# EAGLE design PhotoTriac (EAGLE 7.2.0)
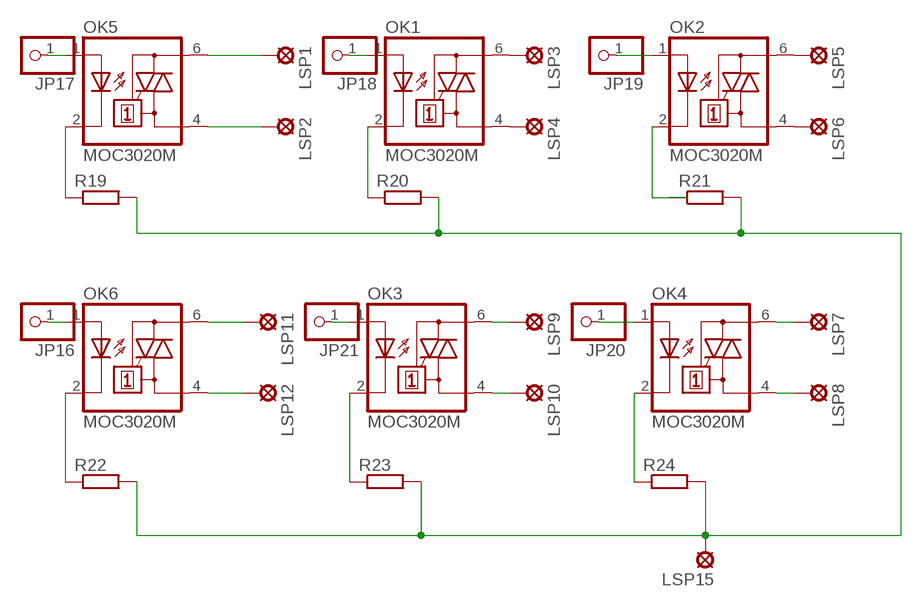
[diagram p0: schematic, sheet 1]

## Parts
JP16  PINHD-1X1  [1X01]
JP17  PINHD-1X1  [1X01]
JP18  PINHD-1X1  [1X01]
JP19  PINHD-1X1  [1X01]
JP20  PINHD-1X1  [1X01]
JP21  PINHD-1X1  [1X01]
LSP1  LSP10  [LSP10]
LSP2  LSP10  [LSP10]
LSP3  LSP10  [LSP10]
LSP4  LSP10  [LSP10]
LSP5  LSP10  [LSP10]
LSP6  LSP10  [LSP10]
LSP7  LSP10  [LSP10]
LSP8  LSP10  [LSP10]
LSP9  LSP10  [LSP10]
LSP10  LSP10  [LSP10]
LSP11  LSP10  [LSP10]
LSP12  LSP10  [LSP10]
LSP15  LSP10  [LSP10]
OK1  MOC3020M  [DIL06]
OK2  MOC3020M  [DIL06]
OK3  MOC3020M  [DIL06]
OK4  MOC3020M  [DIL06]
OK5  MOC3020M  [DIL06]
OK6  MOC3020M  [DIL06]
R19  R-EU_0207/10  [0207/10]
R20  R-EU_0207/10  [0207/10]
R21  R-EU_0207/10  [0207/10]
R22  R-EU_0207/10  [0207/10]
R23  R-EU_0207/10  [0207/10]
R24  R-EU_0207/10  [0207/10]

## Nets
N$39: JP17.1 OK5.1(A)
N$63: JP18.1 OK1.1(A)
N$64: JP19.1 OK2.1(A)
N$66: JP20.1 OK4.1(A)
N$79: LSP1.MP OK5.6(A2)
N$80: LSP2.MP OK5.4(A1)
N$81: LSP3.MP OK1.6(A2)
N$82: LSP4.MP OK1.4(A1)
N$83: LSP5.MP OK2.6(A2)
N$84: LSP6.MP OK2.4(A1)
N$85: LSP7.MP OK4.6(A2)
N$86: LSP8.MP OK4.4(A1)
N$87: LSP9.MP OK3.6(A2)
N$88: LSP10.MP OK3.4(A1)
N$89: LSP11.MP OK6.6(A2)
N$90: LSP12.MP OK6.4(A1)
N$91: JP21.1 OK3.1(A)
N$92: OK2.2(C) R21.1
N$93: OK1.2(C) R20.1
N$94: OK5.2(C) R19.1
N$95: JP16.1 OK6.1(A)
N$96: OK3.2(C) R23.1
N$97: OK4.2(C) R24.1
N$98: OK6.2(C) R22.1
N$122: LSP15.MP R19.2 R20.2 R21.2 R22.2 R23.2 R24.2

## Library data of the parts
JP16-JP21 = pinhead:PINHD-1X1: PIN HEADER
LSP1-LSP12 LSP15 = solpad:LSP10: SOLDER PAD drill 1.0 mm, distributor Buerklin, 12H555
OK1-OK6 = optocoupler:MOC30*M: RANDOM-PHASE OPTOISOLATORS TRIAC DRIVER OUTPUT Source: http://www.fairchildsemi.com MOC3020-M.pdf; MF: FAIRCHILD SEMICONDUCTOR; MPN: MOC3020-M; OC_FARNELL: 1505425; OC_NEWARK: 72K8895
R19-R24 = resistor:R-EU_: RESISTOR, European symbol

## Board
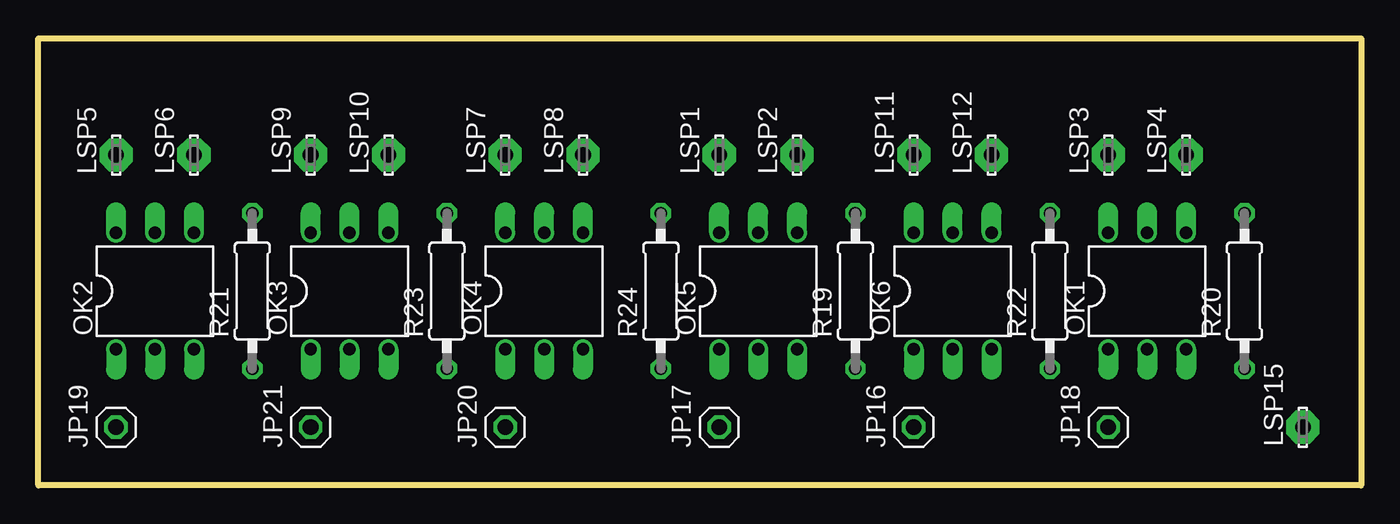
[diagram p1: board, top side]
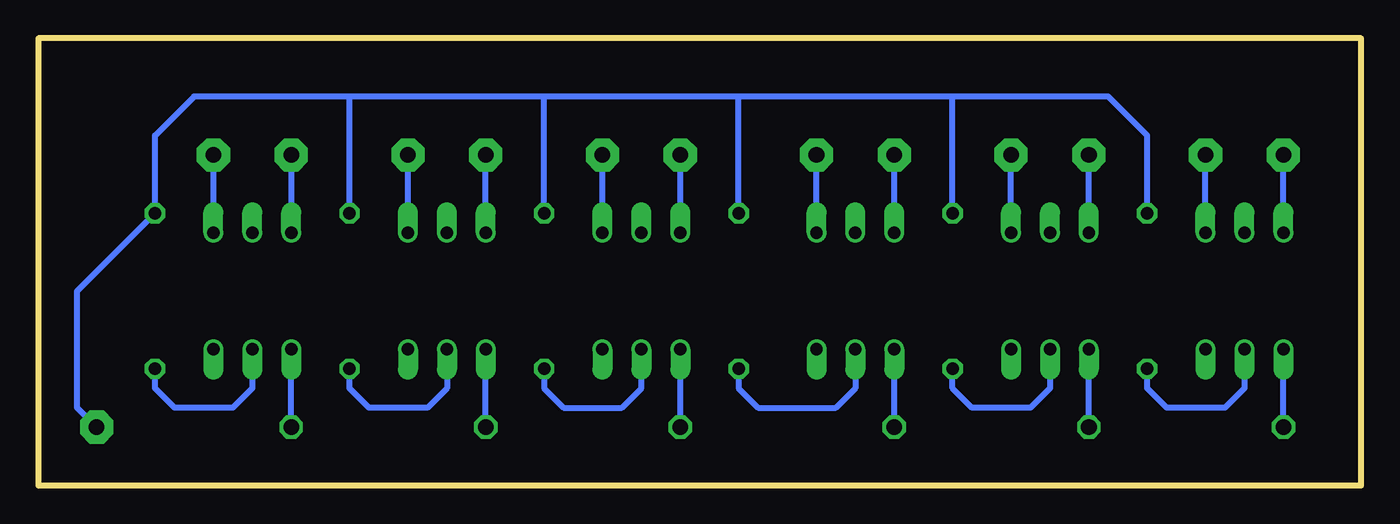
[diagram p2: board, bottom side, seen from below]

Size 86.36 x 29.21 mm. Coordinates in mm from the lower left corner, seen from the top.
Outline: 0,0 0,29.21 86.36,29.21 86.36,0 0,0
Copper layers (1*16): Top 0.035mm / dielectric 1.5mm / Bottom 0.035mm
Design rules "default": minimum track width 10mil, minimum drill 24mil, track to track 8mil, track to pad 8mil, pad to pad 8mil, via to via 8mil, smd to smd 8mil, copper to edge 40mil, drill to drill 8mil, minimum pad ring 10mil, minimum via ring 8mil, stop-mask expansion 4mil, vias tented up to drill 0mil, thermal gap 10mil

### Footprints (pad centres in the part's own frame; a part is rotated, then mirrored left to right if it is on the bottom)
1X01 = drill 1.016 octagon: 1 0,0
LSP10 = drill 1.016 pad 2.159 octagon: MP 0,0
DIL06 = drill 0.813 offset: 1 -2.54,-3.81; 2 0,-3.81; 3 2.54,-3.81; 4 2.54,3.81; 5 0,3.81; 6 -2.54,3.81
0207/10 = drill 0.813 octagon: 1 -5.08,0; 2 5.08,0

### Placement (x,y rotation side)
JP16  57.15,3.81 90 top
JP17  44.45,3.81 90 top
JP18  69.85,3.81 90 top
JP19  5.08,3.81 90 top
JP20  30.48,3.81 90 top
JP21  17.78,3.81 90 top
LSP1  44.45,21.59 90 top
LSP2  49.53,21.59 90 top
LSP3  69.85,21.59 90 top
LSP4  74.93,21.59 90 top
LSP5  5.08,21.59 90 top
LSP6  10.16,21.59 90 top
LSP7  30.48,21.59 90 top
LSP8  35.56,21.59 90 top
LSP9  17.78,21.59 90 top
LSP10  22.86,21.59 90 top
LSP11  57.15,21.59 90 top
LSP12  62.23,21.59 90 top
LSP15  82.55,3.81 90 top
OK1  72.39,12.7 0 top
OK2  7.62,12.7 0 top
OK3  20.32,12.7 0 top
OK4  33.02,12.7 0 top
OK5  46.99,12.7 0 top
OK6  59.69,12.7 0 top
R19  53.34,12.7 90 top
R20  78.74,12.7 90 top
R21  13.97,12.7 90 top
R22  66.04,12.7 90 top
R23  26.67,12.7 90 top
R24  40.64,12.7 90 top

### Tracks (layer width: path | path; a pad name or v marks a point on that pad's centre or on a via)
N$39
  Bottom 0.406: JP17.1 OK5.1
N$63
  Bottom 0.406: JP18.1 OK1.1
N$64
  Bottom 0.406: JP19.1 OK2.1
N$66
  Bottom 0.406: JP20.1 OK4.1
N$79
  Bottom 0.406: OK5.6 LSP1.MP
N$80
  Bottom 0.406: OK5.4 LSP2.MP
N$81
  Bottom 0.406: LSP3.MP OK1.6
N$82
  Bottom 0.406: LSP4.MP OK1.4
N$83
  Bottom 0.406: OK2.6 LSP5.MP
N$84
  Bottom 0.406: OK2.4 LSP6.MP
N$85
  Bottom 0.406: OK4.6 LSP7.MP
N$86
  Bottom 0.406: OK4.4 LSP8.MP
N$87
  Bottom 0.406: OK3.6 LSP9.MP
N$88
  Bottom 0.406: OK3.4 LSP10.MP
N$89
  Bottom 0.406: OK6.6 LSP11.MP
N$90
  Bottom 0.406: OK6.4 LSP12.MP
N$91
  Bottom 0.406: JP21.1 OK3.1
N$92
  Bottom 0.406: OK2.2 7.62,6.35 8.89,5.08 12.7,5.08 13.97,6.35 R21.1
N$93
  Bottom 0.406: OK1.2 72.39,6.35 73.66,5.08 77.47,5.08 78.74,6.35 R20.1
N$94
  Bottom 0.406: R19.1 53.34,6.35 52.07,5.08 48.26,5.08 46.99,6.35 OK5.2
N$95
  Bottom 0.406: JP16.1 OK6.1
N$96
  Bottom 0.406: OK3.2 20.32,6.35 21.59,5.08 25.4,5.08 26.67,6.35 R23.1
N$97
  Bottom 0.406: OK4.2 33.02,6.35 34.29,5.08 39.37,5.08 40.64,6.35 R24.1
N$98
  Bottom 0.406: OK6.2 59.69,6.35 60.96,5.08 64.77,5.08 66.04,6.35 R22.1
N$122
  Bottom 0.406: R21.2 13.97,22.86 16.51,25.4 26.67,25.4 | 26.67,25.4 40.64,25.4 | 40.64,25.4 53.34,25.4 | 53.34,25.4 66.04,25.4 | 66.04,25.4 76.2,25.4 78.74,22.86 R20.2 83.82,12.7 83.82,5.08 LSP15.MP | R23.2 26.67,25.4 | R24.2 40.64,25.4 | R19.2 53.34,25.4 | R22.2 66.04,25.4